# EAGLE design Taster (EAGLE 6.3)
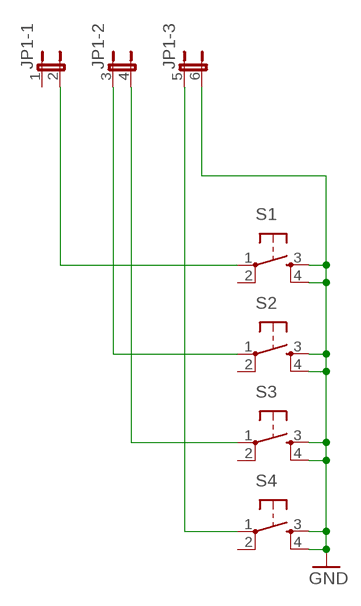
[diagram p0: schematic, sheet 1]

## Parts
JP1  JP3QE  [JP3Q]
S1  TAC_SWITCHPTH  [TACTILE-PTH]
S2  TAC_SWITCHPTH  [TACTILE-PTH]
S3  TAC_SWITCHPTH  [TACTILE-PTH]
S4  TAC_SWITCHPTH  [TACTILE-PTH]

## Nets
GND: JP1.6 S1.3 S1.4 S2.3 S2.4 S3.3 S3.4 S4.3 S4.4
N$2: JP1.2 S1.1
N$3: JP1.3 S2.1
N$4: JP1.4 S3.1
N$5: JP1.5 S4.1
Unconnected: JP1.1 S1.2 S2.2 S3.2 S4.2

## Library data of the parts
JP1 = jumper:JP3QE: JUMPER
S1-S4 = SparkFun:TAC_SWITCH: Momentary Switch Button commonly used for reset or general input. Spark Fun Electronics SKU : COM-00097

## Board
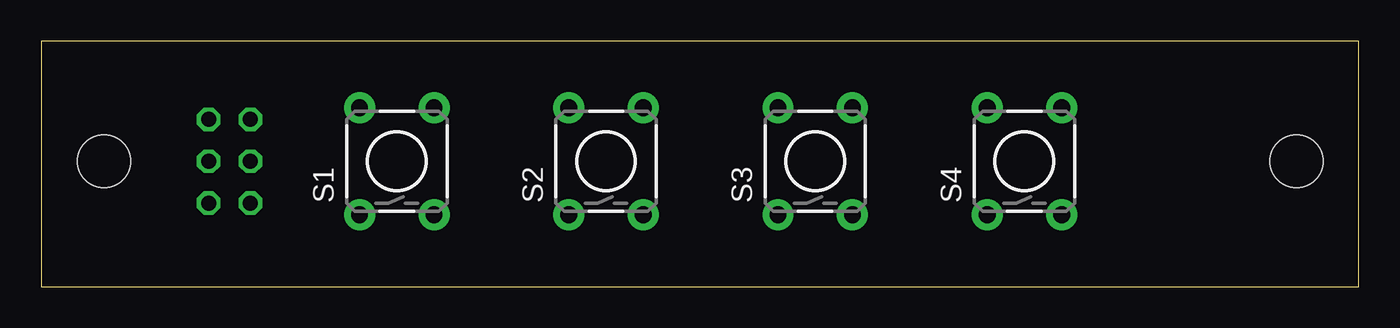
[diagram p1: board, top side]
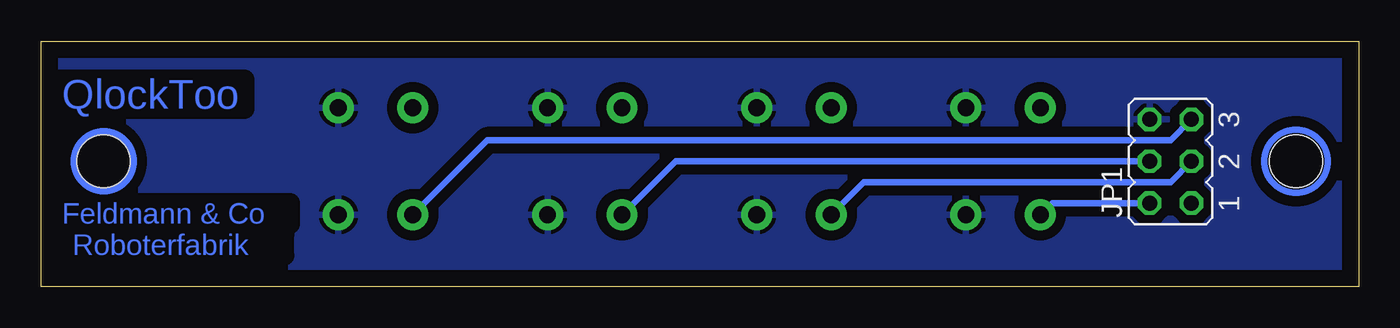
[diagram p2: board, bottom side, seen from below]

Size 79.99 x 14.91 mm. Coordinates in mm from the lower left corner, seen from the top.
Outline: 0,0 79.99,0 79.99,14.91 0,14.91 0,0
Copper layers (1*16): Top 0.035mm / dielectric 1.5mm / Bottom 0.035mm
Design rules "default": minimum track width 10mil, minimum drill 24mil, track to track 8mil, track to pad 8mil, pad to pad 8mil, via to via 8mil, smd to smd 8mil, copper to edge 40mil, drill to drill 8mil, minimum pad ring 10mil, minimum via ring 8mil, stop-mask expansion 4mil, vias tented up to drill 0mil, thermal gap 10mil
Holes 3.2 mm at 3.81,7.62 76.2,7.62

### Footprints (pad centres in the part's own frame; a part is rotated, then mirrored left to right if it is on the bottom)
JP3Q = drill 0.914 octagon: 1 -2.54,-1.27; 2 -2.54,1.27; 3 0,-1.27; 4 0,1.27; 5 2.54,-1.27; 6 2.54,1.27
TACTILE-PTH = drill 1.016 pad 1.88: 1 -3.251,2.261; 2 3.251,2.261; 3 -3.251,-2.261; 4 3.251,-2.261

### Placement (x,y rotation side)
JP1  11.43,7.62 90 bottom
S1  21.59,7.62 90 top
S2  34.29,7.62 90 top
S3  46.99,7.62 90 top
S4  59.69,7.62 90 top

### Tracks (layer width: path | path; a pad name or v marks a point on that pad's centre or on a via)
GND
  pour Bottom (isolate 0.61): 80.01,0 0,0 0,14.61 80.01,14.61
N$2
  Bottom 0.406: JP1.2 18.62,5.08 S1.1
N$3
  Bottom 0.406: JP1.3 11.43,6.35 30.05,6.35 S2.1
N$4
  Bottom 0.406: JP1.4 41.48,7.62 S3.1
N$5
  Bottom 0.406: JP1.5 11.43,8.89 52.91,8.89 S4.1
(copper drawn outside any net)
  shapes: Bottom circle x2

### Text on the board
Bottom: QlockToo | Feldmann & Co | Roboterfabrik